# Altium schematic sheet RK3399 Side of LPDDR4 Controller.SchDoc
size 420 x 297 mm; SheetNumber: 7; SheetTotal: 26
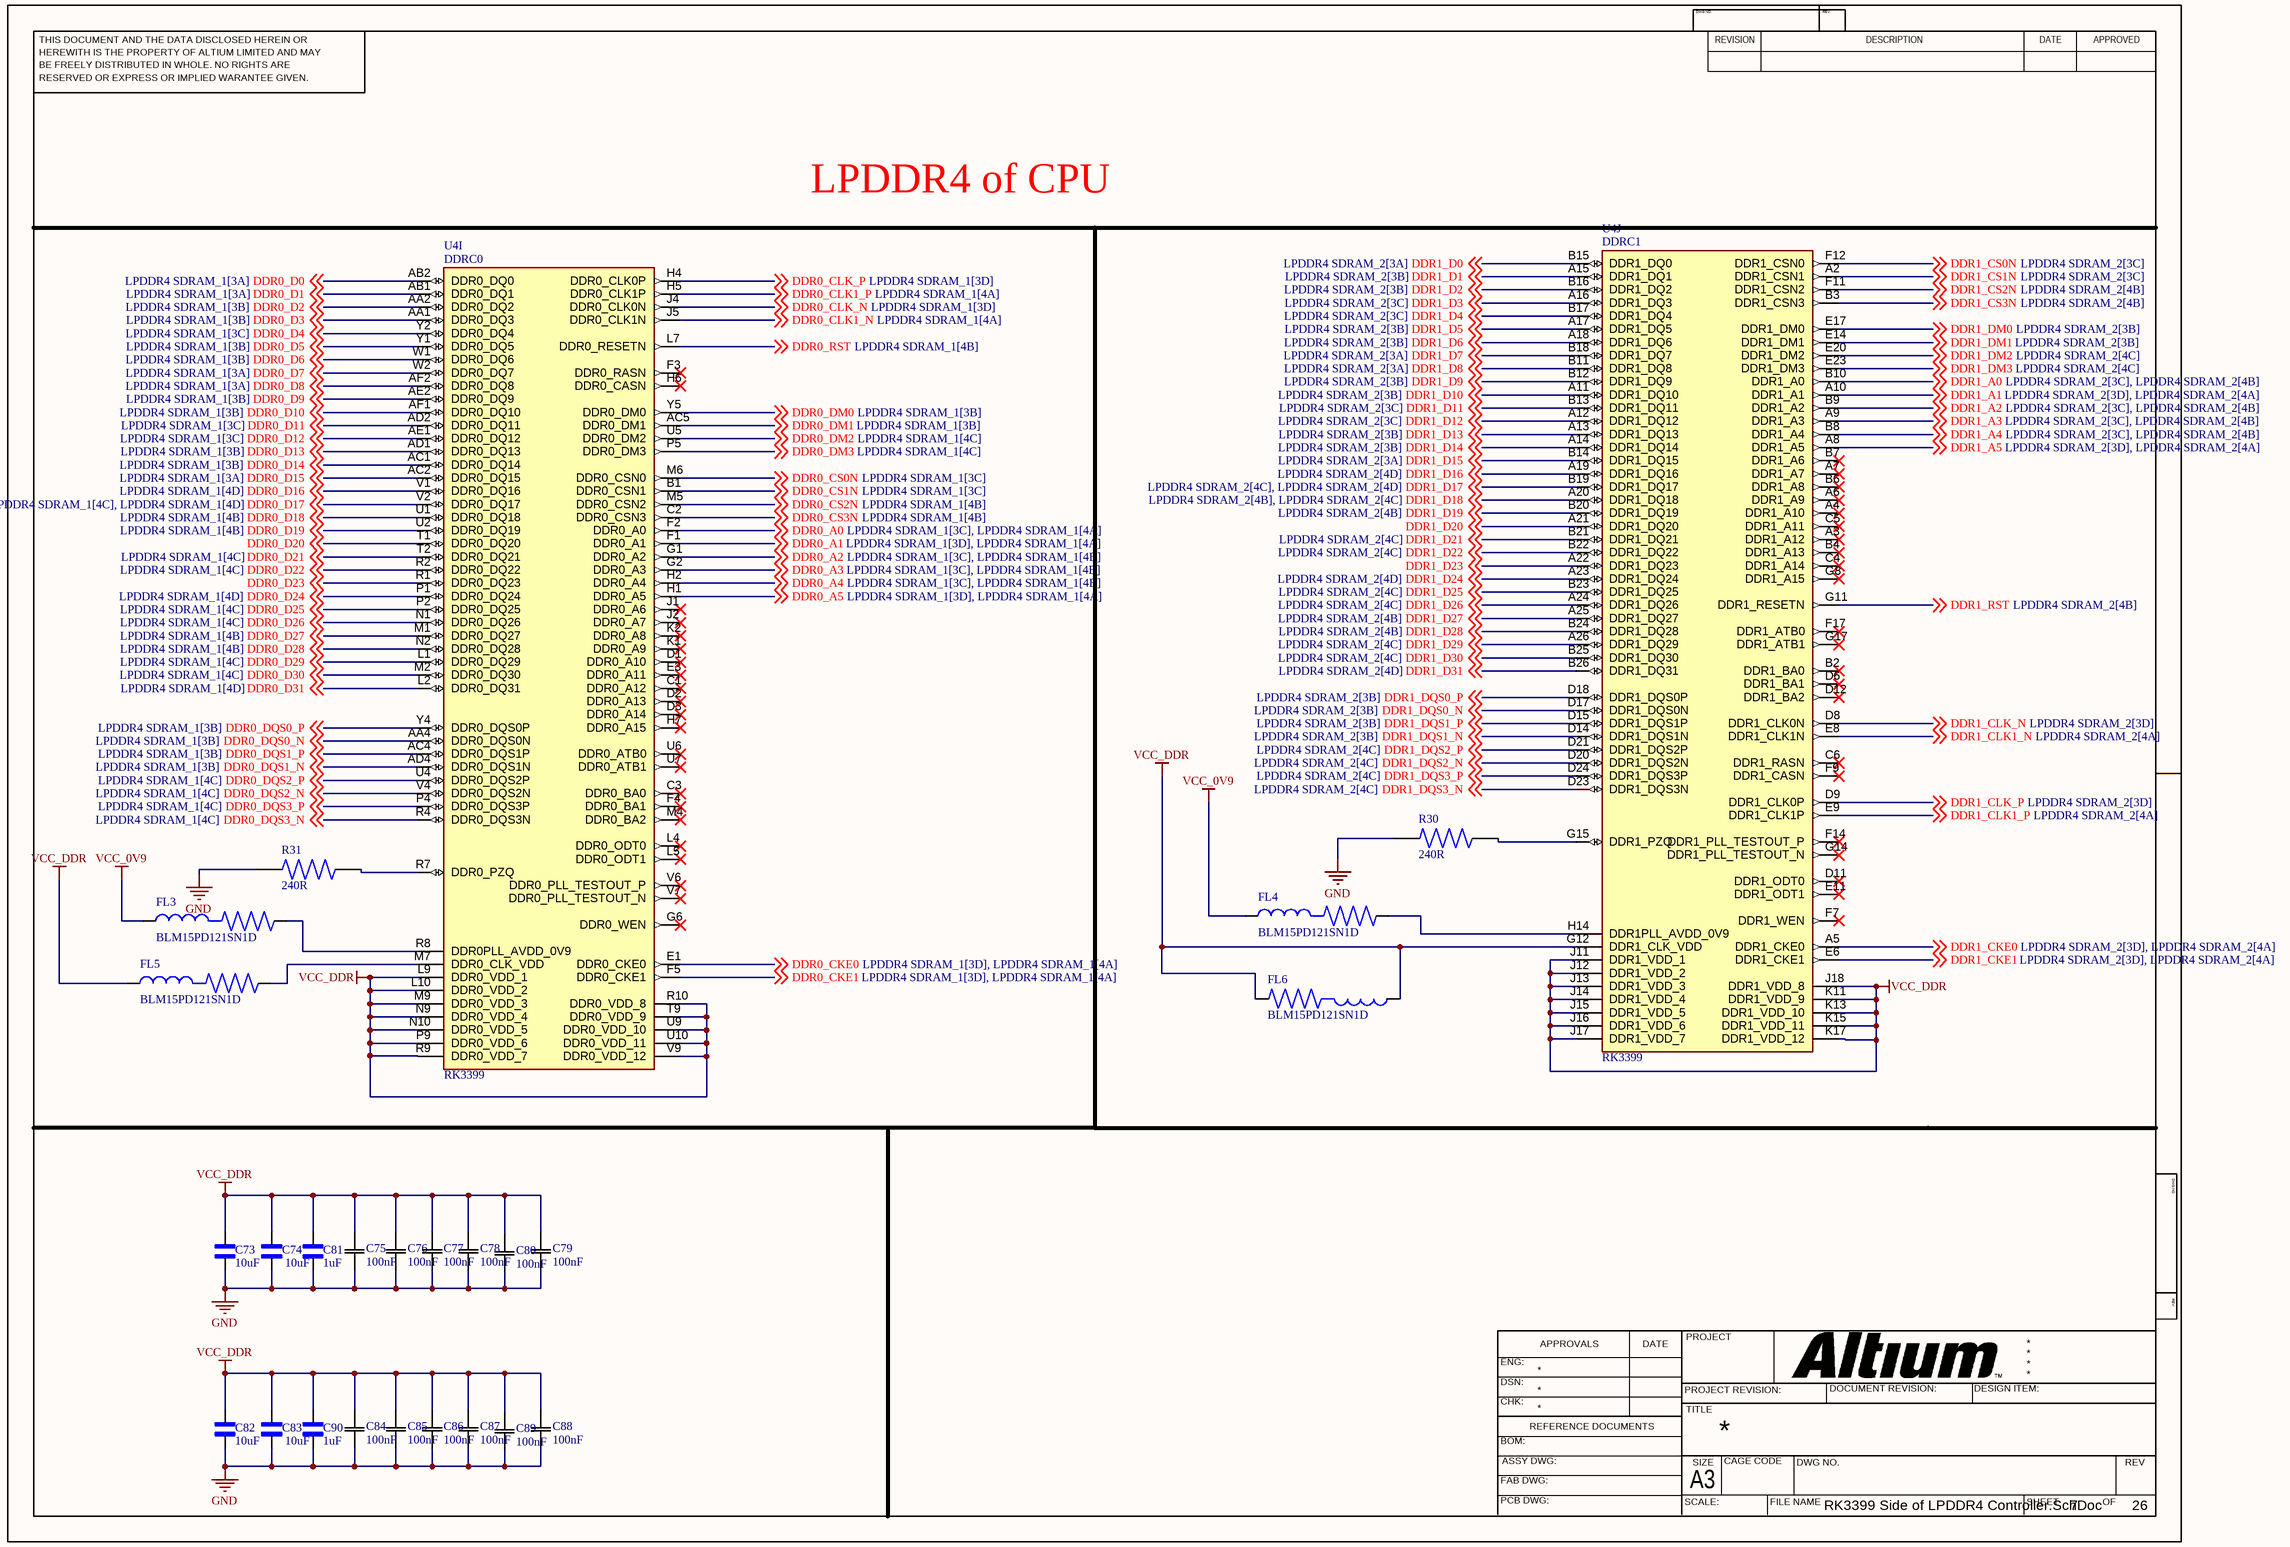
[diagram p0: RK3399 Side of LPDDR4 Controller.SchDoc]

## Parts
C73  10uF  [CAPC1005X71N]
C74  10uF  [CAPC1005X70N]
C75  100nF  [CAP_1005_TDK]
C76  100nF  [CAP_1005_TDK]
C77  100nF  [CAP_1005_TDK]
C78  100nF  [CAP_1005_TDK]
C79  100nF  [CAP_1005_TDK]
C80  100nF  [CAP_1005_TDK]
C81  1uF  [CAPC1005X56N]
C82  10uF  [CAPC1005X71N]
C83  10uF  [CAPC1005X70N]
C84  100nF  [CAP_1005_TDK]
C85  100nF  [CAP_1005_TDK]
C86  100nF  [CAP_1005_TDK]
C87  100nF  [CAP_1005_TDK]
C88  100nF  [CAP_1005_TDK]
C89  100nF  [CAP_1005_TDK]
C90  1uF  [CAPC1005X56N]
FL3  BLM15PD121SN1D  [BEADC1005X55N]
FL4  BLM15PD121SN1D  [BEADC1005X55N]
FL5  BLM15PD121SN1D  [BEADC1005X55N]
FL6  BLM15PD121SN1D  [BEADC1005X55N]
R30  240R  [RES_ERJP08F1101V]
R31  240R  [RESC1608X50N]
U4  RK3399  [BGA828C65P31X31_2100X2100X161N]  (parts I,J of 32)

## Nets
GND: C73.1 C74.1 C75.1 C76.1 C77.1 C78.1 C79.1 C80.1 C81.1 C82.1 C83.1 C84.1 C85.1 C86.1 C87.1 C88.1 C89.1 C90.1 R30.1 R31.1
VCC_0V9: FL3.1 FL4.1
VCC_DDR: C73.2 C74.2 C75.2 C76.2 C77.2 C78.2 C79.2 C80.2 C81.2 C82.2 C83.2 C84.2 C85.2 C86.2 C87.2 C88.2 C89.2 C90.2 FL5.1 FL6.1 FL6.2 U4.G12(DDR1_CLK_VDD) U4.J11(DDR1_VDD_1) U4.J12(DDR1_VDD_2) U4.J13(DDR1_VDD_3) U4.J14(DDR1_VDD_4) U4.J15(DDR1_VDD_5) U4.J16(DDR1_VDD_6) U4.J17(DDR1_VDD_7) U4.J18(DDR1_VDD_8) U4.K11(DDR1_VDD_9) U4.K13(DDR1_VDD_10) U4.K15(DDR1_VDD_11) U4.K17(DDR1_VDD_12) U4.L9(DDR0_VDD_1) U4.L10(DDR0_VDD_2) U4.M9(DDR0_VDD_3) U4.N9(DDR0_VDD_4) U4.N10(DDR0_VDD_5) U4.P9(DDR0_VDD_6) U4.R9(DDR0_VDD_7) U4.R10(DDR0_VDD_8) U4.T9(DDR0_VDD_9) U4.U9(DDR0_VDD_10) U4.U10(DDR0_VDD_11) U4.V9(DDR0_VDD_12)
DDR0_A0: U4.F2(DDR0_A0) ; off-sheet DDR0_A0
DDR0_A1: U4.F1(DDR0_A1) ; off-sheet DDR0_A1
DDR0_A2: U4.G1(DDR0_A2) ; off-sheet DDR0_A2
DDR0_A3: U4.G2(DDR0_A3) ; off-sheet DDR0_A3
DDR0_A4: U4.H2(DDR0_A4) ; off-sheet DDR0_A4
DDR0_A5: U4.H1(DDR0_A5) ; off-sheet DDR0_A5
DDR0_CKE0: U4.E1(DDR0_CKE0) ; off-sheet DDR0_CKE0
DDR0_CKE1: U4.F5(DDR0_CKE1) ; off-sheet DDR0_CKE1
DDR0_CLK1_N: U4.J5(DDR0_CLK1N) ; off-sheet DDR0_CLK1_N
DDR0_CLK1_P: U4.H5(DDR0_CLK1P) ; off-sheet DDR0_CLK1_P
DDR0_CLK_N: U4.J4(DDR0_CLK0N) ; off-sheet DDR0_CLK_N
DDR0_CLK_P: U4.H4(DDR0_CLK0P) ; off-sheet DDR0_CLK_P
DDR0_CS0N: U4.M6(DDR0_CSN0) ; off-sheet DDR0_CS0N
DDR0_CS1N: U4.B1(DDR0_CSN1) ; off-sheet DDR0_CS1N
DDR0_CS2N: U4.M5(DDR0_CSN2) ; off-sheet DDR0_CS2N
DDR0_CS3N: U4.C2(DDR0_CSN3) ; off-sheet DDR0_CS3N
DDR0_D0: U4.AB2(DDR0_DQ0) ; off-sheet DDR0_D0
DDR0_D1: U4.AB1(DDR0_DQ1) ; off-sheet DDR0_D1
DDR0_D2: U4.AA2(DDR0_DQ2) ; off-sheet DDR0_D2
DDR0_D3: U4.AA1(DDR0_DQ3) ; off-sheet DDR0_D3
DDR0_D4: U4.Y2(DDR0_DQ4) ; off-sheet DDR0_D4
DDR0_D5: U4.Y1(DDR0_DQ5) ; off-sheet DDR0_D5
DDR0_D6: U4.W1(DDR0_DQ6) ; off-sheet DDR0_D6
DDR0_D7: U4.W2(DDR0_DQ7) ; off-sheet DDR0_D7
DDR0_D8: U4.AF2(DDR0_DQ8) ; off-sheet DDR0_D8
DDR0_D9: U4.AE2(DDR0_DQ9) ; off-sheet DDR0_D9
DDR0_D10: U4.AF1(DDR0_DQ10) ; off-sheet DDR0_D10
DDR0_D11: U4.AD2(DDR0_DQ11) ; off-sheet DDR0_D11
DDR0_D12: U4.AE1(DDR0_DQ12) ; off-sheet DDR0_D12
DDR0_D13: U4.AD1(DDR0_DQ13) ; off-sheet DDR0_D13
DDR0_D14: U4.AC1(DDR0_DQ14) ; off-sheet DDR0_D14
DDR0_D15: U4.AC2(DDR0_DQ15) ; off-sheet DDR0_D15
DDR0_D16: U4.V1(DDR0_DQ16) ; off-sheet DDR0_D16
DDR0_D17: U4.V2(DDR0_DQ17) ; off-sheet DDR0_D17
DDR0_D18: U4.U1(DDR0_DQ18) ; off-sheet DDR0_D18
DDR0_D19: U4.U2(DDR0_DQ19) ; off-sheet DDR0_D19
DDR0_D20: U4.T1(DDR0_DQ20) ; off-sheet DDR0_D20
DDR0_D21: U4.T2(DDR0_DQ21) ; off-sheet DDR0_D21
DDR0_D22: U4.R2(DDR0_DQ22) ; off-sheet DDR0_D22
DDR0_D23: U4.R1(DDR0_DQ23) ; off-sheet DDR0_D23
DDR0_D24: U4.P1(DDR0_DQ24) ; off-sheet DDR0_D24
DDR0_D25: U4.P2(DDR0_DQ25) ; off-sheet DDR0_D25
DDR0_D26: U4.N1(DDR0_DQ26) ; off-sheet DDR0_D26
DDR0_D27: U4.M1(DDR0_DQ27) ; off-sheet DDR0_D27
DDR0_D28: U4.N2(DDR0_DQ28) ; off-sheet DDR0_D28
DDR0_D29: U4.L1(DDR0_DQ29) ; off-sheet DDR0_D29
DDR0_D30: U4.M2(DDR0_DQ30) ; off-sheet DDR0_D30
DDR0_D31: U4.L2(DDR0_DQ31) ; off-sheet DDR0_D31
DDR0_DM0: U4.Y5(DDR0_DM0) ; off-sheet DDR0_DM0
DDR0_DM1: U4.AC5(DDR0_DM1) ; off-sheet DDR0_DM1
DDR0_DM2: U4.U5(DDR0_DM2) ; off-sheet DDR0_DM2
DDR0_DM3: U4.P5(DDR0_DM3) ; off-sheet DDR0_DM3
DDR0_DQS0_N: U4.AA4(DDR0_DQS0N) ; off-sheet DDR0_DQS0_N
DDR0_DQS0_P: U4.Y4(DDR0_DQS0P) ; off-sheet DDR0_DQS0_P
DDR0_DQS1_N: U4.AD4(DDR0_DQS1N) ; off-sheet DDR0_DQS1_N
DDR0_DQS1_P: U4.AC4(DDR0_DQS1P) ; off-sheet DDR0_DQS1_P
DDR0_DQS2_N: U4.V4(DDR0_DQS2N) ; off-sheet DDR0_DQS2_N
DDR0_DQS2_P: U4.U4(DDR0_DQS2P) ; off-sheet DDR0_DQS2_P
DDR0_DQS3_N: U4.R4(DDR0_DQS3N) ; off-sheet DDR0_DQS3_N
DDR0_DQS3_P: U4.P4(DDR0_DQS3P) ; off-sheet DDR0_DQS3_P
DDR0_RST: U4.L7(DDR0_RESETN) ; off-sheet DDR0_RST
DDR1_A0: U4.B10(DDR1_A0) ; off-sheet DDR1_A0
DDR1_A1: U4.A10(DDR1_A1) ; off-sheet DDR1_A1
DDR1_A2: U4.B9(DDR1_A2) ; off-sheet DDR1_A2
DDR1_A3: U4.A9(DDR1_A3) ; off-sheet DDR1_A3
DDR1_A4: U4.B8(DDR1_A4) ; off-sheet DDR1_A4
DDR1_A5: U4.A8(DDR1_A5) ; off-sheet DDR1_A5
DDR1_CKE0: U4.A5(DDR1_CKE0) ; off-sheet DDR1_CKE0
DDR1_CKE1: U4.E6(DDR1_CKE1) ; off-sheet DDR1_CKE1
DDR1_CLK1_N: U4.E8(DDR1_CLK1N) ; off-sheet DDR1_CLK1_N
DDR1_CLK1_P: U4.E9(DDR1_CLK1P) ; off-sheet DDR1_CLK1_P
DDR1_CLK_N: U4.D8(DDR1_CLK0N) ; off-sheet DDR1_CLK_N
DDR1_CLK_P: U4.D9(DDR1_CLK0P) ; off-sheet DDR1_CLK_P
DDR1_CS0N: U4.F12(DDR1_CSN0) ; off-sheet DDR1_CS0N
DDR1_CS1N: U4.A2(DDR1_CSN1) ; off-sheet DDR1_CS1N
DDR1_CS2N: U4.F11(DDR1_CSN2) ; off-sheet DDR1_CS2N
DDR1_CS3N: U4.B3(DDR1_CSN3) ; off-sheet DDR1_CS3N
DDR1_D0: U4.B15(DDR1_DQ0) ; off-sheet DDR1_D0
DDR1_D1: U4.A15(DDR1_DQ1) ; off-sheet DDR1_D1
DDR1_D2: U4.B16(DDR1_DQ2) ; off-sheet DDR1_D2
DDR1_D3: U4.A16(DDR1_DQ3) ; off-sheet DDR1_D3
DDR1_D4: U4.B17(DDR1_DQ4) ; off-sheet DDR1_D4
DDR1_D5: U4.A17(DDR1_DQ5) ; off-sheet DDR1_D5
DDR1_D6: U4.A18(DDR1_DQ6) ; off-sheet DDR1_D6
DDR1_D7: U4.B18(DDR1_DQ7) ; off-sheet DDR1_D7
DDR1_D8: U4.B11(DDR1_DQ8) ; off-sheet DDR1_D8
DDR1_D9: U4.B12(DDR1_DQ9) ; off-sheet DDR1_D9
DDR1_D10: U4.A11(DDR1_DQ10) ; off-sheet DDR1_D10
DDR1_D11: U4.B13(DDR1_DQ11) ; off-sheet DDR1_D11
DDR1_D12: U4.A12(DDR1_DQ12) ; off-sheet DDR1_D12
DDR1_D13: U4.A13(DDR1_DQ13) ; off-sheet DDR1_D13
DDR1_D14: U4.A14(DDR1_DQ14) ; off-sheet DDR1_D14
DDR1_D15: U4.B14(DDR1_DQ15) ; off-sheet DDR1_D15
DDR1_D16: U4.A19(DDR1_DQ16) ; off-sheet DDR1_D16
DDR1_D17: U4.B19(DDR1_DQ17) ; off-sheet DDR1_D17
DDR1_D18: U4.A20(DDR1_DQ18) ; off-sheet DDR1_D18
DDR1_D19: U4.B20(DDR1_DQ19) ; off-sheet DDR1_D19
DDR1_D20: U4.A21(DDR1_DQ20) ; off-sheet DDR1_D20
DDR1_D21: U4.B21(DDR1_DQ21) ; off-sheet DDR1_D21
DDR1_D22: U4.B22(DDR1_DQ22) ; off-sheet DDR1_D22
DDR1_D23: U4.A22(DDR1_DQ23) ; off-sheet DDR1_D23
DDR1_D24: U4.A23(DDR1_DQ24) ; off-sheet DDR1_D24
DDR1_D25: U4.B23(DDR1_DQ25) ; off-sheet DDR1_D25
DDR1_D26: U4.A24(DDR1_DQ26) ; off-sheet DDR1_D26
DDR1_D27: U4.A25(DDR1_DQ27) ; off-sheet DDR1_D27
DDR1_D28: U4.B24(DDR1_DQ28) ; off-sheet DDR1_D28
DDR1_D29: U4.A26(DDR1_DQ29) ; off-sheet DDR1_D29
DDR1_D30: U4.B25(DDR1_DQ30) ; off-sheet DDR1_D30
DDR1_D31: U4.B26(DDR1_DQ31) ; off-sheet DDR1_D31
DDR1_DM0: U4.E17(DDR1_DM0) ; off-sheet DDR1_DM0
DDR1_DM1: U4.E14(DDR1_DM1) ; off-sheet DDR1_DM1
DDR1_DM2: U4.E20(DDR1_DM2) ; off-sheet DDR1_DM2
DDR1_DM3: U4.E23(DDR1_DM3) ; off-sheet DDR1_DM3
DDR1_DQS0_N: U4.D17(DDR1_DQS0N) ; off-sheet DDR1_DQS0_N
DDR1_DQS0_P: U4.D18(DDR1_DQS0P) ; off-sheet DDR1_DQS0_P
DDR1_DQS1_N: U4.D14(DDR1_DQS1N) ; off-sheet DDR1_DQS1_N
DDR1_DQS1_P: U4.D15(DDR1_DQS1P) ; off-sheet DDR1_DQS1_P
DDR1_DQS2_N: U4.D20(DDR1_DQS2N) ; off-sheet DDR1_DQS2_N
DDR1_DQS2_P: U4.D21(DDR1_DQS2P) ; off-sheet DDR1_DQS2_P
DDR1_DQS3_N: U4.D23(DDR1_DQS3N) ; off-sheet DDR1_DQS3_N
DDR1_DQS3_P: U4.D24(DDR1_DQS3P) ; off-sheet DDR1_DQS3_P
DDR1_RST: U4.G11(DDR1_RESETN) ; off-sheet DDR1_RST
NetFL3_2: FL3.2 U4.R8(DDR0PLL_AVDD_0V9)
NetFL4_2: FL4.2 U4.H14(DDR1PLL_AVDD_0V9)
NetFL5_2: FL5.2 U4.M7(DDR0_CLK_VDD)
NetR30_2: R30.2 U4.G15(DDR1_PZQ)
NetR31_2: R31.2 U4.R7(DDR0_PZQ)

Not connected (* = marked no-connect by the designer): U4 A3(DDR1_A12)* A4(DDR1_A10)* A6(DDR1_A9)* A7(DDR1_A7)* B2(DDR1_BA0)* B4(DDR1_A13)* B6(DDR1_A8)* B7(DDR1_A6)* C1(DDR0_A12)* C3(DDR0_BA0)* C4(DDR1_A14)* C5(DDR1_A11)* C6(DDR1_RASN)* D1(DDR0_A10)* D2(DDR0_A13)* D3(DDR0_A14)* D6(DDR1_BA1)* D11(DDR1_ODT0)* D12(DDR1_BA2)* E3(DDR0_A11)* E11(DDR1_ODT1)* F3(DDR0_RASN)* F4(DDR0_BA1)* F7(DDR1_WEN)* F9(DDR1_CASN)* F14(DDR1_PLL_TESTOUT_P)* F17(DDR1_ATB0)* G6(DDR0_WEN)* G8(DDR1_A15)* G14(DDR1_PLL_TESTOUT_N)* G17(DDR1_ATB1)* H6(DDR0_CASN)* H7(DDR0_A15)* J1(DDR0_A6)* J2(DDR0_A7)* K1(DDR0_A9)* K2(DDR0_A8)* L4(DDR0_ODT0)* L5(DDR0_ODT1)* M4(DDR0_BA2)* U6(DDR0_ATB0)* U7(DDR0_ATB1)* V6(DDR0_PLL_TESTOUT_P)* V7(DDR0_PLL_TESTOUT_N)*

## Notes on the sheet
- LPDDR4 of CPU
- THIS DOCUMENT AND THE DATA DISCLOSED HEREIN OR
- HEREWITH IS THE PROPERTY OF ALTIUM LIMITED AND MAY
- DWG NO:
- REVISION
- REV:
- DESCRIPTION
- DATE
- APPROVED
- BE FREELY DISTRIBUTED IN WHOLE. NO RIGHTS ARE
- RESERVED OR EXPRESS OR IMPLIED WARANTEE GIVEN.
- ENG:
- APPROVALS
- PROJECT
- DSN:
- CHK:
- REFERENCE DOCUMENTS
- PROJECT REVISION:
- TITLE
- DOCUMENT REVISION:
- DESIGN ITEM:
- BOM:
- FAB DWG:
- PCB DWG:
- ASSY DWG:
- SCALE:
- A3
- SIZE
- CAGE CODE
- FILE NAME
- DWG NO.
- SHEET
- OF
- REV
- (in symbol RK3399, part I) DDRC0
- (in symbol RK3399, part J) DDRC1

## Library data of the parts
C73 C82 = 04026D226MAT2A: 22 ÂµF Â±20% 6.3V Ceramic Capacitor X5R 0402 (1005 Metric); MF: AVX; SnapEDA_Link: https://www.snapeda.com/parts/04026D226MAT2A/AVX/view-part/?ref=snap; Package: 1005 AVX; Value: *; MP: 04026D226MAT2A; Check_prices: https://www.snapeda.com/parts/04026D226MAT2A/AVX/view-part/?ref=eda
C74 C83 = CL05A106MQ5NUNC: 10 ÂµF Â±20% 6.3V Ceramic Capacitor X5R 0402 (1005 Metric); MF: Samsung; SnapEDA_Link: https://www.snapeda.com/parts/CL05A106MQ5NUNC/Samsung/view-part/?ref=snap; Package: SMD-2 Samsung; Value: *; MP: CL05A106MQ5NUNC; Check_prices: https://www.snapeda.com/parts/CL05A106MQ5NUNC/Samsung/view-part/?ref=eda
C75-C80 C84-C89 = C1005X7R1H104M050BB: Description; Manufacturer_Name: TDK; Copyright: Copyright (C) 2025 Ultra Librarian. All rights reserved.; Manufacturer_Part_Number: C1005X7R1H104M050BB
C81 C90 = 0402ZD105KAT4A: 1 ÂµF Â±10% 10V Ceramic Capacitor X5R 0402 (1005 Metric); MF: AVX; SnapEDA_Link: https://www.snapeda.com/parts/0402ZD105KAT4A/AVX/view-part/?ref=snap; Package: 1005 AVX; Value: *; MP: 0402ZD105KAT4A; Check_prices: https://www.snapeda.com/parts/0402ZD105KAT4A/AVX/view-part/?ref=eda
FL3-FL6 = BLM15PD121SN1D: 120 Ohms @ 100 MHz 1 Power Line Ferrite Bead 0402 (1005 Metric) 1.3A 90mOhm; MF: Murata; SnapEDA_Link: https://www.snapeda.com/parts/BLM15PD121SN1D/Murata/view-part/?ref=snap; Package: 1005 Taiyo Yuden; Value: *; MP: BLM15PD121SN1D; Check_prices: https://www.snapeda.com/parts/BLM15PD121SN1D/Murata/view-part/?ref=eda
R30 R31 = ERA6AED241V: Value: *; Availability: Unavailable; Price: None; Package: None; MP: ERA6AED241V
U4 = RK3399: RK3399 ROCK Pi 4 Model A 2GB - ARMÂ® CortexÂ®-A53, CortexÂ®-A72 MPU Embedded Evaluation Board; MF: Rockchip; SnapEDA_Link: https://www.snapeda.com/parts/RK3399/Fuzhou+Rockchip+Electronics+Co/view-part/?ref=snap; Package: Seeed Technology; MP: RK3399; Check_prices: https://www.snapeda.com/parts/RK3399/Fuzhou+Rockchip+Electronics+Co/view-part/?ref=eda; Price: None; Value: *; Availability: Not in stock